# Altium schematic sheet ModDS3231.SchDoc
size 420 x 297 mm; Address1: Address1; Address2: Address2; Address3: Address3; Address4: Address4; SheetNumber: 1; Scale: 1:1; Разраб.: Лепотенко А.С.; Обозначение документа: ЛАС.4367523.004Э3; Перв. применение: ЛАС.4367523.004; Наименование изделия 1: Блок часов RTC; Наименование изделия 2: Схема электрическая; Наименование изделия 3: принципиальная; Нач. отд.: Нач. отд.
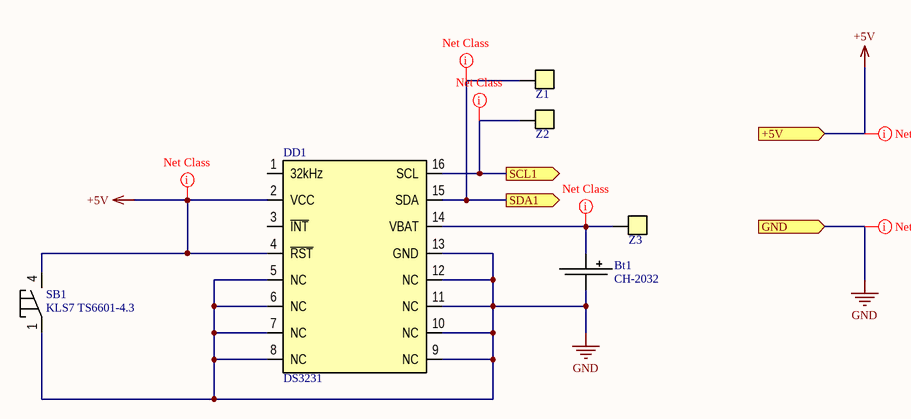
[diagram p0: ModDS3231.SchDoc]

## Parts
Bt1  CH-2032  [CH25-2032]
DD1  DS3231  [SO-16]
SB1  KLS7 TS6601-4.3  [KLS2]
Z1  test Point  [test Point]  (value not drawn)
Z2  test Point  [test Point]  (value not drawn)
Z3  test Point  [test Point]  (value not drawn)

## Ports
+5V (in), GND (in), SCL1 (out), SDA1 (out)

## Nets
+5V: DD1.2(VCC) DD1.4(~{RST}) SB1.4 ; port +5V
GND: Bt1.2 DD1.5(NC) DD1.6(NC) DD1.7(NC) DD1.8(NC) DD1.9(NC) DD1.10(NC) DD1.11(NC) DD1.12(NC) DD1.13(GND) SB1.1 ; port GND
SCL1: DD1.16(SCL) Z2.1 ; port SCL1
SDA1: DD1.15(SDA) Z1.1 ; port SDA1
NetBt1_1: Bt1.1 DD1.14(VBAT) Z3.1

Not connected (* = marked no-connect by the designer): DD1 1(32kHz) 3(~{INT})

## Layout directives
net class Power5V_3V3: +5V, NetBt1_1
net class DigitalNet: SCL1, SDA1
net class Power24V: GND

## Notes on the sheet
- Перв. примен.
- Справ. №
- Подп. и дата
- Инв. № дубл.
- Взам. инв. №
- Разраб.
- Изм.
- Лист
- № докум.
- Подп.
- Дата
- Лит.
- Масса
- Масштаб
- Пров.
- Т.контр.
- Листов
- Инв. № подл.
- Утв.
- Н.контр.
- Копировал
- Формат А3

## Library data of the parts
Bt1 = CR-2032: Manufacturer: Comf; Value: 2032; Quantity: 2; Part Number: CH25-2032; Package: CH25-2032; Price: 0.36; ShoppingPlace: http://belchip.by/product/?selected_product=12241
DD1 = DS3231: Part Number: DS3231SN; Manufacture: Maxim Integrated Products; Value: RTC; Packge: SO-16; Price: 4; Quantity: 1; ShoppingPlace: http://belchip.by/product/?selected_product=06391
SB1 = Button: Manufacturer: KLS; Value: 100VDC; Part Number: KLS7 TS6601-4.3; Price: 0,04; ShoppingPlace: http://belchip.by/product/?selected_product=02682; Quantity: 6; Package: KLS2